# Altium schematic sheet BoardB-Camera.SchDoc
size A; SheetNumber: 7; SheetTotal: 9
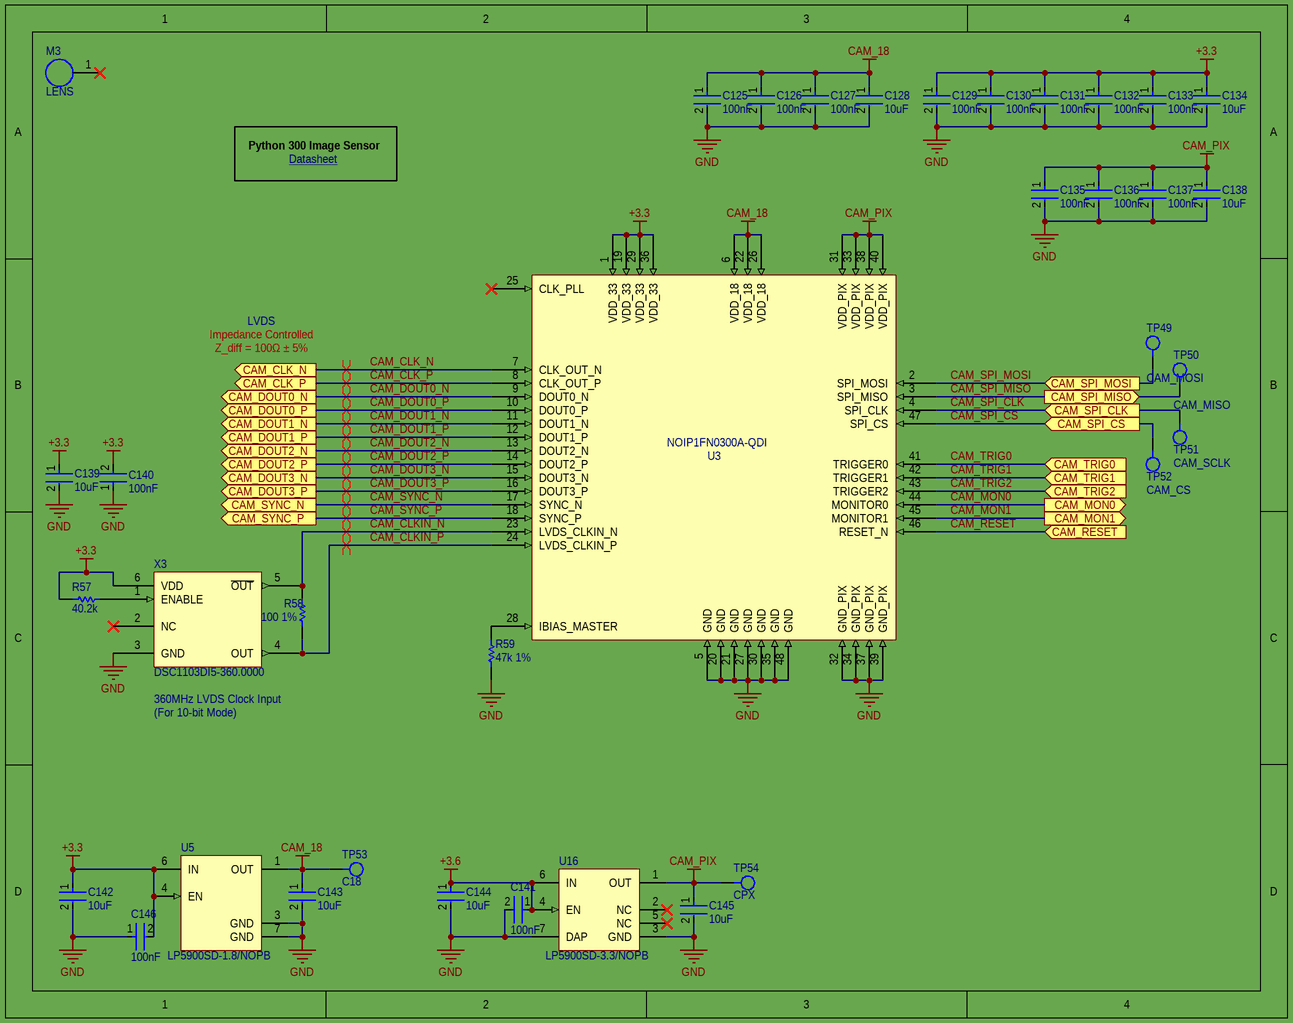
[diagram p0: BoardB-Camera.SchDoc]

## Parts
C125  100nF  [FP-CGA3E-0_3-0_1-IPC_A]
C126  100nF  [FP-CGA3E-0_3-0_1-IPC_A]
C127  100nF  [FP-CGA3E-0_3-0_1-IPC_A]
C128  10uF  [FP-GRM188-0_1-e0_2_0_55-IPC_A]
C129  100nF  [FP-CGA3E-0_3-0_1-IPC_A]
C130  100nF  [FP-CGA3E-0_3-0_1-IPC_A]
C131  100nF  [FP-CGA3E-0_3-0_1-IPC_A]
C132  100nF  [FP-CGA3E-0_3-0_1-IPC_A]
C133  100nF  [FP-CGA3E-0_3-0_1-IPC_A]
C134  10uF  [FP-GRM188-0_1-e0_2_0_55-IPC_A]
C135  100nF  [FP-CGA3E-0_3-0_1-IPC_A]
C136  100nF  [FP-CGA3E-0_3-0_1-IPC_A]
C137  100nF  [FP-CGA3E-0_3-0_1-IPC_A]
C138  10uF  [FP-GRM188-0_1-e0_2_0_55-IPC_A]
C139  10uF  [FP-GRM188-0_1-e0_2_0_55-IPC_A]
C140  100nF  [FP-CGA3E-0_3-0_1-IPC_A]
C141  100nF  [FP-CGA3E-0_3-0_1-IPC_A]
C142  10uF  [FP-GRM188-0_1-e0_2_0_55-IPC_A]
C143  10uF  [FP-GRM188-0_1-e0_2_0_55-IPC_A]
C144  10uF  [FP-GRM188-0_1-e0_2_0_55-IPC_A]
C145  10uF  [FP-GRM188-0_1-e0_2_0_55-IPC_A]
C146  100nF  [FP-CGA3E-0_3-0_1-IPC_A]
M3  LENS  [LENS_MNT]
R57  40.2k  [RESC1005X40X25LL05T05]
R58  100 1%  [RESC1005X40X25LL05T05]
R59  47k 1%  [RESC1005X40X25NL05T05]
TP49  CAM_MOSI  [TestPoint1mm]
TP50  CAM_MISO  [TestPoint1mm]
TP51  CAM_SCLK  [TestPoint1mm]
TP52  CAM_CS  [TestPoint1mm]
TP53  C18  [TestPoint1mm]
TP54  CPX  [TestPoint1mm]
U3  NOIP1FN0300A-QDI  [NOIP1FN0300A-QDI]
U5  LP5900SD-1.8/NOPB  [LP5900-WSON]
U16  LP5900SD-3.3/NOPB  [NGF0006A_V]
X3  DSC1103DI5-360.0000  [DSC1103DI5-360.0000]

## Ports
CAM_CLK_N (out), CAM_CLK_P (out), CAM_DOUT0_N (out), CAM_DOUT0_P (out), CAM_DOUT1_N (out), CAM_DOUT1_P (out), CAM_DOUT2_N (out), CAM_DOUT2_P (out), CAM_DOUT3_N (out), CAM_DOUT3_P (out), CAM_MON0 (out), CAM_MON1 (out), CAM_RESET (in), CAM_SPI_CLK (in), CAM_SPI_CS (in), CAM_SPI_MISO (out), CAM_SPI_MOSI (in), CAM_SYNC_N (out), CAM_SYNC_P (out), CAM_TRIG0 (in), CAM_TRIG1 (in), CAM_TRIG2 (in)

## Nets
+3.3: C129.1 C130.1 C131.1 C132.1 C133.1 C134.1 C139.1 C140.2 C142.1 C146.2 R57.1 U3.1(VDD_33) U3.19(VDD_33) U3.29(VDD_33) U3.36(VDD_33) U5.4(EN) U5.6(IN) X3.6(VDD)
+3.6: C141.1 C144.1 U16.4(EN) U16.6(IN)
CAM_18: C125.1 C126.1 C127.1 C128.1 C143.1 TP53.1 U3.6(VDD_18) U3.22(VDD_18) U3.26(VDD_18) U5.1(OUT)
CAM_PIX: C135.1 C136.1 C137.1 C138.1 C145.1 TP54.1 U3.31(VDD_PIX) U3.33(VDD_PIX) U3.38(VDD_PIX) U3.40(VDD_PIX) U16.1(OUT)
GND: C125.2 C126.2 C127.2 C128.2 C129.2 C130.2 C131.2 C132.2 C133.2 C134.2 C135.2 C136.2 C137.2 C138.2 C139.2 C140.1 C141.2 C142.2 C143.2 C144.2 C145.2 C146.1 R59.1 U3.5(GND) U3.20(GND) U3.21(GND) U3.27(GND) U3.30(GND) U3.32(GND_PIX) U3.34(GND_PIX) U3.35(GND) U3.37(GND_PIX) U3.39(GND_PIX) U3.48(GND) U5.3(GND) U5.7(GND) U16.3(GND) U16.7(DAP) X3.3(GND)
CAM_CLK_N: U3.7(CLK_OUT_N) ; port CAM_CLK_N
CAM_CLK_P: U3.8(CLK_OUT_P) ; port CAM_CLK_P
CAM_CLKIN_N: R58.2 U3.23(LVDS_CLKIN_N) X3.5(~{OUT})
CAM_CLKIN_P: R58.1 U3.24(LVDS_CLKIN_P) X3.4(OUT)
CAM_DOUT0_N: U3.9(DOUT0_N) ; port CAM_DOUT0_N
CAM_DOUT0_P: U3.10(DOUT0_P) ; port CAM_DOUT0_P
CAM_DOUT1_N: U3.11(DOUT1_N) ; port CAM_DOUT1_N
CAM_DOUT1_P: U3.12(DOUT1_P) ; port CAM_DOUT1_P
CAM_DOUT2_N: U3.13(DOUT2_N) ; port CAM_DOUT2_N
CAM_DOUT2_P: U3.14(DOUT2_P) ; port CAM_DOUT2_P
CAM_DOUT3_N: U3.15(DOUT3_N) ; port CAM_DOUT3_N
CAM_DOUT3_P: U3.16(DOUT3_P) ; port CAM_DOUT3_P
CAM_MON0: U3.44(MONITOR0) ; port CAM_MON0
CAM_MON1: U3.45(MONITOR1) ; port CAM_MON1
CAM_RESET: U3.46(RESET_N) ; port CAM_RESET
CAM_SPI_CLK: TP51.1 U3.4(SPI_CLK) ; port CAM_SPI_CLK
CAM_SPI_CS: TP52.1 U3.47(SPI_CS) ; port CAM_SPI_CS
CAM_SPI_MISO: TP50.1 U3.3(SPI_MISO) ; port CAM_SPI_MISO
CAM_SPI_MOSI: TP49.1 U3.2(SPI_MOSI) ; port CAM_SPI_MOSI
CAM_SYNC_N: U3.17(SYNC_N) ; port CAM_SYNC_N
CAM_SYNC_P: U3.18(SYNC_P) ; port CAM_SYNC_P
CAM_TRIG0: U3.41(TRIGGER0) ; port CAM_TRIG0
CAM_TRIG1: U3.42(TRIGGER1) ; port CAM_TRIG1
CAM_TRIG2: U3.43(TRIGGER2) ; port CAM_TRIG2
NetR57_2: R57.2 X3.1(ENABLE)
NetR59_2: R59.2 U3.28(IBIAS_MASTER)

Not connected (* = marked no-connect by the designer): M3 1*; U3 25(CLK_PLL)*; U16 2(NC)* 5(NC)*; X3 2(NC)*

## Layout directives
differential pair; differential pair class CAM_CLK_OUT; rule Signal Stimulus [Kind - Single Pulse    Level - High    Start Time = 0.000    Stop Time = 1.389n    Period Time = 2.778n]: CAM_CLK_N, CAM_CLK_P
differential pair; differential pair class CAM_DOUT0; rule Signal Stimulus [Kind - Single Pulse    Level - High    Start Time = 0.000    Stop Time = 1.389n    Period Time = 2.778n]: CAM_DOUT0_N, CAM_DOUT0_P
differential pair; differential pair class CAM_DOUT1; rule Signal Stimulus [Kind - Single Pulse    Level - High    Start Time = 0.000    Stop Time = 1.389n    Period Time = 2.778n]: CAM_DOUT1_N, CAM_DOUT1_P
differential pair; differential pair class CAM_DOUT2; rule Signal Stimulus [Kind - Single Pulse    Level - High    Start Time = 0.000    Stop Time = 1.389n    Period Time = 2.778n]: CAM_DOUT2_N, CAM_DOUT2_P
differential pair; differential pair class CAM_DOUT3; rule Signal Stimulus [Kind - Single Pulse    Level - High    Start Time = 0.000    Stop Time = 1.389n    Period Time = 2.778n]: CAM_DOUT3_N, CAM_DOUT3_P
differential pair; differential pair class CAM_SYNC; rule Signal Stimulus [Kind - Single Pulse    Level - High    Start Time = 0.000    Stop Time = 1.389n    Period Time = 2.778n]: CAM_SYNC_N, CAM_SYNC_P
differential pair; differential pair class CAM_CLKIN: CAM_CLKIN_N, CAM_CLKIN_P

## Notes on the sheet
- Python 300 Image Sensor
- Datasheet <https://www.onsemi.com/pdf/datasheet/noip1sn1300a-d.pdf>
- LVDS
- Impedance Controlled
- Z_diff = 100Ω ± 5%
- (near X3) 360MHz LVDS Clock Input
- (For 10-bit Mode)

## Library data of the parts
C125-C127 C129-C133 C135-C137 C140 C141 C146 = CMP-2000-07546-2: Cap Ceramic 100nF 50V X7R 10% Pad SMD 0603 +125°C Automotive T/R; Weight: 7.1E-05oz; Composition: Ceramic; Max Operating Temperature: 125°C; Termination: SMD/SMT; Dielectric: X7R; Length: 1.6mm; Package Quantity: 1; REACH SVHC: No SVHC; Lead Free: Lead Free; Case Code (Metric): 1608; Min Operating Temperature: -55°C; Packaging: Tape and Reel; Tolerance: 10%; Voltage Rating: 50V; Case Code (Imperial): 0603; Capacitance: 100nF; Case/Package: 0603; Voltage Rating (DC): 50V; Depth: 0.8mm; Radiation Hardening: No; Ratings: AEC-Q200; Mount: Surface Mount; Voltage: 50V; Thickness: 0.035inch; Width: 0.8mm; Height: 0.8mm
C128 C134 C138 C139 C142-C145 = CMP-2006-02792-2: Chip Multilayer Ceramic Capacitors for General Purpose, 0603, 10uF, X5R, 15%, 20%, 6.3V; Packaging: Tape and Reel; Voltage Rating (DC): 6.3V; Width: 0.031inch; Termination: SMD/SMT; Dielectric: X5R; Package Quantity: 4000; Voltage Rating: 6.3V; Capacitance: 10uF; Case/Package: 0603; Min Operating Temperature: -55°C; Voltage: 6.3V; Length: 1.6mm; Thickness: 0.035inch; Lead Free: Lead Free; Depth: 0.8mm; Case Code (Imperial): 0603; Max Operating Temperature: 85°C; Material: Ceramic; Height: 0.8mm; Tolerance: 20%; Mount: Surface Mount; REACH SVHC: No SVHC; Radiation Hardening: No; Case Code (Metric): 1608
M3 = LENS_MNT
R57 = CMP-2002-00919-1: Manufacturer: Panasonic; Part Number: ERJ-2RKF4022X
R58 = CMP-2002-00605-3: Chip Resistor, 100 Ohm, +/- 1%, 100 mW, -55 to 155 degC, 0402 (1005 Metric), RoHS, Tape and Reel; Manufacturer: Basic Passives; PartNumber: ERJ-2RKF1000X; Power Rating: 100 mW; Resistance: 100 Ohm; Voltage Rating: 50 V; Case\/Package: 0402; Width: 0.5 mm; Pins: 2; ComponentLink2Description: Datasheet; PackageReference: 0402; Height: 0.35 mm; Tolerance: 1%; DatasheetVersion: 04/2015; Case Code (Imperial): 0402; Min Operating Temperature: -55 degC; Radiation Hardening: No; Length: 1 mm; Package Quantity: 10000; PackageDescription: 2-Pin Surface Mount Device, Body 1 x 0.5 mm; Mounting Technology: Surface Mount; Case Code (Metric): 1005; Packaging: Tape and Reel; ComponentLink1URL: http://www.panasonic.com/; RoHSCompliant: true; Max Operating Temperature: 155 degC; REACH SVHC: Yes; ComponentLink1Description: Manufacturer URL; ComponentLink2URL: http://industrial.panasonic.com/cdbs/www-data/pdf/RDA0000/AOA0000C86.pdf; Mount: Surface Mount
R59 = CMP-2002-01155-1: Part Number: ERJ2RKF4702X; Manufacturer: Panasonic
TP49-TP54 = TestPoint1mm: Test Point 1mm Diameter
U3 = NOIP1FN0300A-QDI: IC IMAGE SENSOR 0.3MP 48LCC; Manufacturer: ON Semiconductor; Operating Supply Voltage: 3.4V; Supplier 1: Avnet; Manufacturer Part Number: NOIP1FN0300A-QDI; RoHS: Yes; Category: Optoelectronics; Pricing 1: 6=58.23675, 8=57.37875, 20=56.62800, 30=55.87725, 60=55.12650, 300=53.83950, 600=53.41050 (USD); Mount: Surface Mount; Case/Package: LCC; Number of Pins: 48; Min Operating Temperature: -40°C; Max Operating Temperature: 85°C; Lead Free: Lead Free; RoHS Compliant: Yes; ComponentLink1URL: http://www.onsemi.com/pub_link/Collateral/PB_NOIP1SN1300A-D.PDF?src-supplier=Digi-Key; ComponentLink1Description: http://www.onsemi.com/pub_link/Collateral/PB_NOIP1SN1300A-D.PDF?src-supplier=Digi-Key; ComponentLink2URL: http://www.onsemi.com/pub_link/Collateral/NOIP1SN1300A-D.PDF?src-supplier=Avnet+Asia; ComponentLink2Description: http://www.onsemi.com/pub_link/Collateral/NOIP1SN1300A-D.PDF?src-supplier=Avnet+Asia; Supplier Part Number 1: NOIP1FN0300A-QDI
U5 = LP5900SD-1.8/NOPB: TEXAS INSTRUMENTS         LP5900SD-1.8/NOPB.             LDO VOLTAGE REGULATOR, 3.3V, 150mA, LLP-6, FULL REEL; Output Voltage: 1.8V; Min Input Voltage: 2.5V; Max Input Voltage: 5.5V; Number of Outputs: 1; Polarity: Positive; Quiescent Current: 50uA; Accuracy: 2%; Output Type: Fixed; Dropout Voltage: 150mV; Supplier 1: Digi-Key; RoHS: Yes; Stock 1: 9836; Pricing 1: 1=0.87000, 10=0.77000, 25=0.72280, 100=0.59000, 250=0.54800, 500=0.46640 (USD); Mount: Surface Mount; Number of Pins: 6; Min Operating Temperature: -40°C; Max Operating Temperature: 125°C; Output Current: 150mA; Package Quantity: 1000; Max Output Current: 150mA; Nominal Output Voltage: 1.8V; Packaging: Tape and Reel; Output Voltage Accuracy: 2%; Length: 2.2mm; Width: 2.5mm; Height: 0.8mm; Radiation Hardening: No; REACH SVHC: No SVHC; Lead Free: Lead Free; RoHS Compliant: Yes; ComponentLink1URL: https://datasheet.ciiva.com/6598/lp5900-6598182.pdf?src-supplier=Digi-Key; ComponentLink1Description: https://datasheet.ciiva.com/6598/lp5900-6598182.pdf?src-supplier=Digi-Key; ComponentLink2URL: https://datasheet.ciiva.com/6598/lp5900-6598185.pdf?src-supplier=Digi-Key; ComponentLink2Description: https://datasheet.ciiva.com/6598/lp5900-6598185.pdf?src-supplier=Digi-Key; ComponentLink3URL: https://datasheet.ciiva.com/6598/lp5900-6598187.pdf?src-supplier=Digi-Key; ComponentLink3Description: https://datasheet.ciiva.com/6598/lp5900-6598187.pdf?src-supplier=Digi-Key; ComponentLink4URL: https://datasheet.ciiva.com/26175/lp5900-26175289.pdf?src-supplier=Avnet+Europe; ComponentLink4Description: https://datasheet.ciiva.com/26175/lp5900-26175289.pdf?src-supplier=Avnet+Europe; ComponentLink5URL: https://datasheet.ciiva.com/14278/lp5900-14278125.pdf?src-supplier=Avnet; ComponentLink5Description: https://datasheet.ciiva.com/14278/lp5900-14278125.pdf?src-supplier=Avnet; ComponentLink6URL: https://datasheet.ciiva.com/28643/1772310-28643116.pdf?src-supplier=Element14; ComponentLink6Description: https://datasheet.ciiva.com/28643/1772310-28643116.pdf?src-supplier=Element14; ComponentLink7URL: https://datasheet.ciiva.com/22678/1772310-22678013.pdf?src-supplier=Element14; ComponentLink7Description: https://datasheet.ciiva.com/22678/1772310-22678013.pdf?src-supplier=Element14; Category: Voltage Regulators - Linear; Manufacturer Part Number: LP5900SD-1.8/NOPB; Manufacturer: Texas Instruments; Supplier Part Number 1: LP5900SD-1.8/NOPBCT-ND
U16 = CMP-0062-01367-3: Ultra Low Noise, 150mA Linear Regulator for RF/Analog Circuits Requires No Bypass Capacitor, 6-pin LLP, Pb-Free; Manufacturer: Texas Instruments; PackageTopMarking: XTT*L16; CompType: LDO IC; PowerWise: N; ComponentLink1URL: http://www.ti.com/general/docs/lit/getliterature.tsp?genericPartNumber=LP5900&fileType=pdf; PinCount: 6; PackageDescription: LLP, Plastic, Dual, 2.2 x 2.5 x 0.8mm Body, 6 Lead, 0.65mm Pitch, No Pullback; RoHS: Y; ComponentLink1Description: Datasheet URL; PackageReference: NGF0006A
X3 = DSC1103DI5-360.0000: Mems Oscillator, Low Power, Lvds, -40C-85C, 10Ppm, 2.5X2.0Mm6 Vdfn 2.0X2.5Mm Tube; Manufacturer: Microchip; Supplier 1: Digi-Key; Manufacturer Part Number: DSC1103DI5-360.0000; RoHS: Yes; Category: Oscillators; Stock 1: 706; Pricing 1: 1=5.51000, 25=4.59000, 100=4.51500 (USD); RoHS Compliant: Yes; Supplier Part Number 1: DSC1103DI5-360.0000-ND